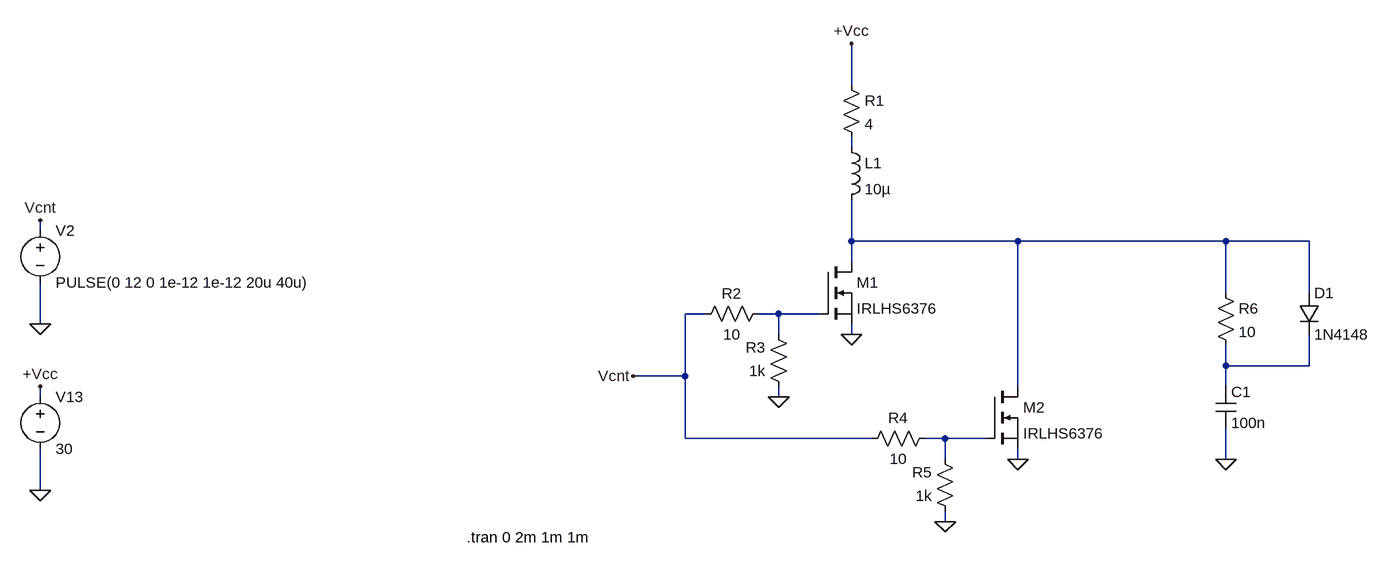
[diagram p0: schematic snubber circuit.asc]
snubber circuit.asc, the LTspice schematic file:
Version 4
SHEET 1 2312 1080
WIRE -1600 176 -1600 112
WIRE -1600 272 -1600 256
WIRE -2848 400 -2848 384
WIRE -1600 416 -1600 352
WIRE -1344 416 -1600 416
WIRE -1024 416 -1344 416
WIRE -896 416 -1024 416
WIRE -1600 448 -1600 416
WIRE -1024 496 -1024 416
WIRE -896 496 -896 416
WIRE -1824 528 -1856 528
WIRE -1712 528 -1744 528
WIRE -1648 528 -1712 528
WIRE -2848 544 -2848 480
WIRE -1712 560 -1712 528
WIRE -1600 560 -1600 544
WIRE -1024 608 -1024 576
WIRE -896 608 -896 560
WIRE -896 608 -1024 608
WIRE -1856 624 -1856 528
WIRE -1856 624 -1936 624
WIRE -1344 640 -1344 416
WIRE -1024 640 -1024 608
WIRE -2848 656 -2848 640
WIRE -1712 656 -1712 640
WIRE -1856 720 -1856 624
WIRE -1568 720 -1856 720
WIRE -1456 720 -1488 720
WIRE -1392 720 -1456 720
WIRE -1456 752 -1456 720
WIRE -1344 752 -1344 736
WIRE -1024 752 -1024 704
WIRE -2848 800 -2848 736
WIRE -1456 848 -1456 832
FLAG -2848 800 0
FLAG -2848 640 +Vcc
FLAG -1600 560 0
FLAG -1344 752 0
FLAG -1712 656 0
FLAG -1456 848 0
FLAG -1600 112 +Vcc
FLAG -2848 544 0
FLAG -2848 384 Vcnt
FLAG -1936 624 Vcnt
FLAG -1024 752 0
SYMBOL voltage -2848 640 R0
WINDOW 123 0 0 Left 0
WINDOW 39 0 0 Left 0
SYMATTR InstName V13
SYMATTR Value 30
SYMBOL res -1616 160 R0
SYMATTR InstName R1
SYMATTR Value 4
SYMBOL ind -1616 256 R0
SYMATTR InstName L1
SYMATTR Value 10µ
SYMBOL nmos -1648 448 R0
SYMATTR InstName M1
SYMATTR Value IRLHS6376
SYMBOL nmos -1392 640 R0
SYMATTR InstName M2
SYMATTR Value IRLHS6376
SYMBOL res -1728 512 R90
WINDOW 0 0 56 VBottom 2
WINDOW 3 32 56 VTop 2
SYMATTR InstName R2
SYMATTR Value 10
SYMBOL res -1696 656 R180
WINDOW 0 36 76 Left 2
WINDOW 3 36 40 Left 2
SYMATTR InstName R3
SYMATTR Value 1k
SYMBOL res -1472 704 R90
WINDOW 0 0 56 VBottom 2
WINDOW 3 32 56 VTop 2
SYMATTR InstName R4
SYMATTR Value 10
SYMBOL res -1440 848 R180
WINDOW 0 36 76 Left 2
WINDOW 3 36 40 Left 2
SYMATTR InstName R5
SYMATTR Value 1k
SYMBOL cap -1040 640 R0
SYMATTR InstName C1
SYMATTR Value 100n
SYMBOL voltage -2848 384 R0
WINDOW 123 0 0 Left 0
WINDOW 39 0 0 Left 0
SYMATTR InstName V2
SYMATTR Value PULSE(0 12 0 1e-12 1e-12 20u 40u)
SYMBOL res -1040 480 R0
SYMATTR InstName R6
SYMATTR Value 10
SYMBOL diode -912 496 R0
SYMATTR InstName D1
SYMATTR Value 1N4148
TEXT -2192 872 Left 2 !.tran 0 2m 1m 1m

The netlist it stands for:
* snubber circuit.asc
V13 +Vcc 0 30
R1 +Vcc N001 4
L1 N001 N002 10µ
M1 N002 N003 0 0 IRLHS6376
M2 N002 N005 0 0 IRLHS6376
R2 N003 Vcnt 10
R3 0 N003 1k
R4 N005 Vcnt 10
R5 0 N005 1k
C1 N004 0 100n
V2 Vcnt 0 PULSE(0 12 0 1e-12 1e-12 20u 40u)
R6 N002 N004 10
D1 N002 N004 1N4148
.model D D
.lib standard.dio
.model NMOS NMOS
.model PMOS PMOS
.lib standard.mos
.tran 0 2m 1m 1m
.backanno
.end